# Altium schematic sheet USB.SchDoc
size A; SheetNumber: 2; SheetTotal: 4
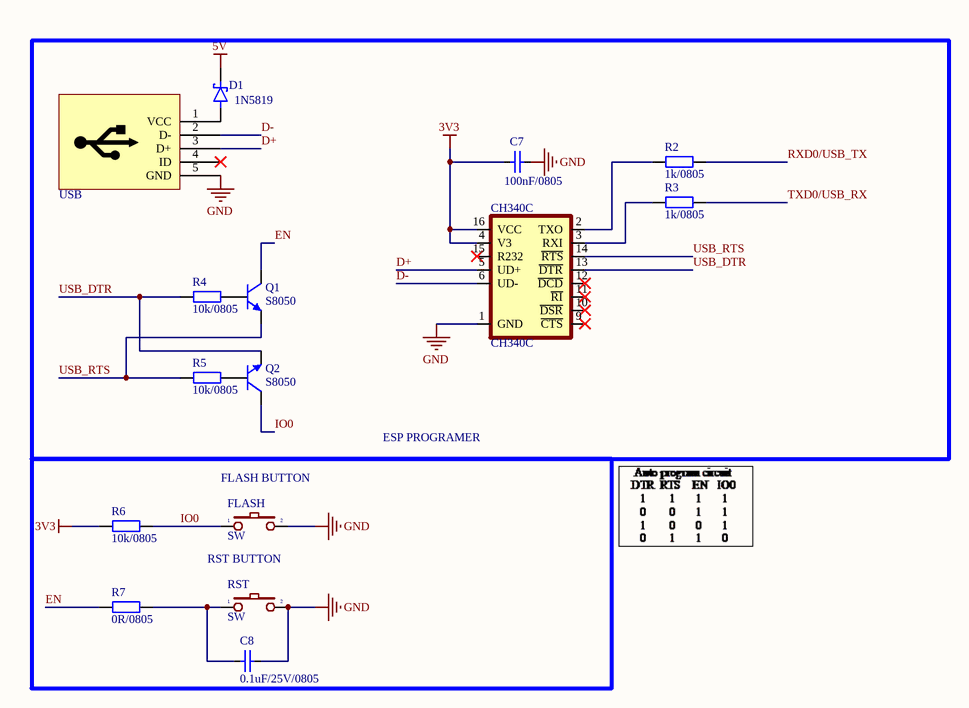
[diagram p0: USB.SchDoc]

## Parts
C7  100nF/0805  [CAP_0805]
C8  0.1uF/25V/0805  [CAP_0805]
CH340C  CH340C  [SOP-16]
D1  1N5819  [SOD3715X145N]
FLASH  SW  [SW-SMD]
Q1  S8050  [SOT23]
Q2  S8050  [SOT23]
R2  1k/0805  [RES-SMD-0805]
R3  1k/0805  [RES-SMD-0805]
R4  10k/0805  [RES-SMD-0805]
R5  10k/0805  [RES-SMD-0805]
R6  10k/0805  [RES-SMD-0805]
R7  0R/0805  [RES-SMD-0805]
RST  SW  [SW-SMD]
USB  USB  [HRS_ZX62D-B-5P8]  (value not drawn)

## Blocks framed on the sheet
ESP PROGRAMER: C7 CH340C D1 Q1 Q2 R2-R5 USB

## Nets
3V3: C7.1 CH340C.4(V3) CH340C.16(VCC) R6.2
5V: D1.C(K)
GND: C7.2 C8.2 CH340C.1(GND) FLASH.2 RST.2 USB.5(GND)
D+: CH340C.5(UD+) USB.3(D+)
D-: CH340C.6(UD-) USB.2(D-)
EN: Q1.2(C) R7.2
IO0: FLASH.1 Q2.2(C) R6.1
RXD0/USB_TX: R2.2
TXD0/USB_RX: R3.2
USB_DTR: CH340C.13(~{DTR}) Q2.1(E) R4.2
USB_RTS: CH340C.14(~{RTS}) Q1.1(E) R5.2
NetC8_1: C8.1 R7.1 RST.1
NetCH340C_2: CH340C.2(TXO) R2.1
NetCH340C_3: CH340C.3(RXI) R3.1
NetD1_A: D1.A USB.1(VCC)
NetQ1_3: Q1.3(B) R4.1
NetQ2_3: Q2.3(B) R5.1

Not connected (* = marked no-connect by the designer): CH340C 9(~{CTS})* 10(~{DSR})* 11(~{RI})* 12(~{DCD})* 15(R232)*; USB 4(ID)*

## Notes on the sheet
- (near FLASH) FLASH BUTTON
- RST BUTTON

## Library data of the parts
C7 C8 = CapSMD: Capacitor; Value: 33p; Published: 8-Jun-2000; LatestRevisionDate: 17-Jul-2002; LatestRevisionNote: Re-released for DXP Platform.; PackageReference: RAD-0.3; Publisher: Altium Limited
CH340C = CH340C: USB to serial chip CH340; MF: WCH; Package: Package; Check_prices: https://www.snapeda.com/parts/CH340C/WCH/view-part/5428851/?ref=eda; Value: *; Price: None; MP: CH340C; Availability: Unavailable; SnapEDA_Link: https://www.snapeda.com/parts/CH340C/WCH/view-part/5428851/?ref=snap
D1 = 1N5819HW-7-F: Diode Schottky 40 V 1A Surface Mount SOD-123; MF: Diodes Inc.; Value: *; SnapEDA_Link: https://www.snapeda.com/parts/1N5819HW-7-F/Diodes+Inc./view-part/?ref=snap; Purchase-URL: https://pricing.snapeda.com/search/part/1N5819HW-7-F/?ref=eda; Availability: In Stock; Price: None; Package: SOD-123 Fairchild Semiconductor; Check_prices: https://www.snapeda.com/parts/1N5819HW-7-F/Diodes+Inc./view-part/?ref=eda; MP: 1N5819HW-7-F
FLASH RST = SW2: Switch button 2 pin; Value: SW chip 2 pin
Q1 Q2 = NPN: NPN General; Published: 8-Jun-2000; LatestRevisionDate: 15-Jan-2003; LatestRevisionNote: PCB Footprint 'BCY-W3/D4.7' replaced; DatasheetDocument: 1997; PackageDocument: Sep-1998; PackageReference: TO-92A; Publisher: Altium Limited; Code_JEDEC: TO-92A; ComponentLink1Description: Manufacturer Link; ComponentLink1URL: http://www.fairchildsemi.com/; ComponentLink2Description: Datasheet; ComponentLink2URL: http://www.fairchildsemi.com/ds/2N%2F2N3904.pdf
R2-R7 = Resistor - SMD: Resistor SMD; Manufacturer: Generic Components; Class: Passive; Published: 08/06/2000; Publisher: Altium Hobart Technology Centre
USB = USB-M